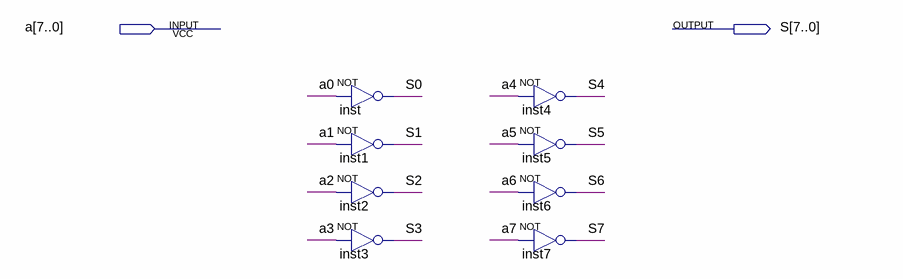
[diagram p0: schematic sheet]
// Quartus schematic not_8bits.bdf as structural Verilog: 8 symbols, 2 pins
module not_8bits (
  input  [7:0] a,
  output [7:0] S
);

  not inst (S[0], a[0]);
  not inst1 (S[1], a[1]);
  not inst2 (S[2], a[2]);
  not inst3 (S[3], a[3]);
  not inst4 (S[4], a[4]);
  not inst5 (S[5], a[5]);
  not inst6 (S[6], a[6]);
  not inst7 (S[7], a[7]);
endmodule
